# Altium schematic sheet CSX_Capsense.SchDoc
size A3
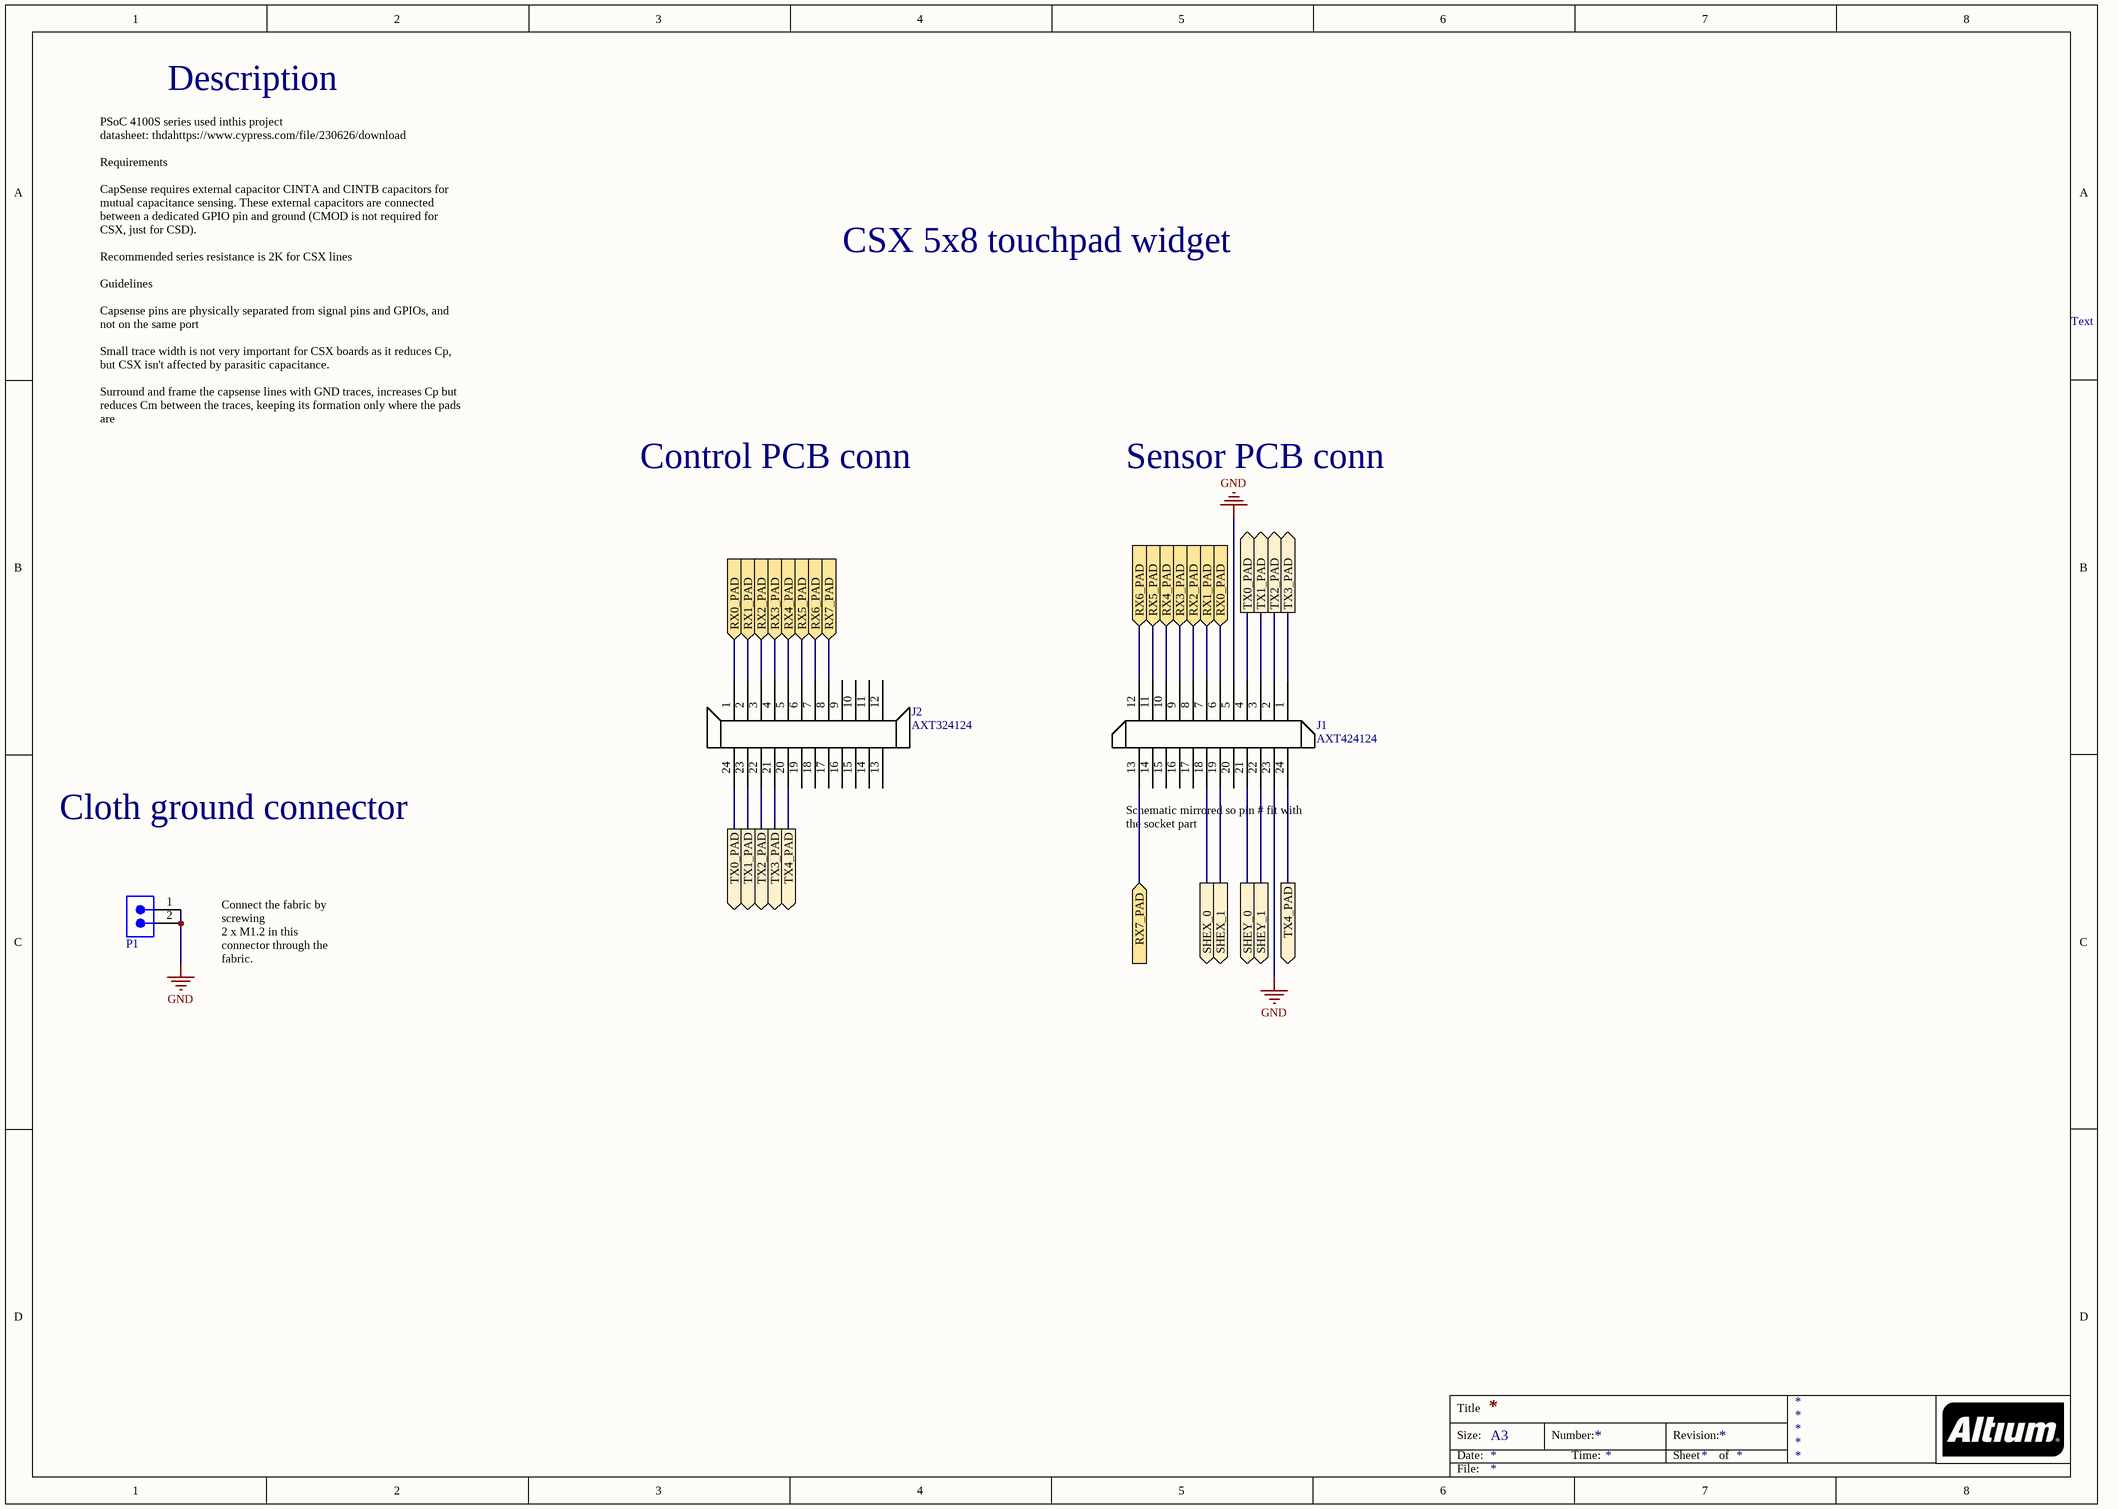
[diagram p0: CSX_Capsense.SchDoc]

## Parts
J1  AXT424124  [AXT424124]
J2  AXT324124  [AXT324124]
P1  MTLW-102-05-T-S-172  [SMTC-MTLW-102-05-X-S-172]  (value not drawn)

## Ports
RX0_PAD (in), RX1_PAD (in), RX2_PAD (in), RX3_PAD (in), RX4_PAD (in), RX5_PAD (in), RX6_PAD (in), RX7_PAD (in), SHEX_0 (out), SHEX_1 (out), SHEY_0 (out), SHEY_1 (out), TX0_PAD (out), TX1_PAD (out), TX2_PAD (out), TX3_PAD (out), TX4_PAD (out)

## Nets
GND: J1.5 J1.23 P1.1 P1.2
RX0_PAD: J1.6 J2.1 ; port RX0_PAD
RX1_PAD: J1.7 J2.2 ; port RX1_PAD
RX2_PAD: J1.8 J2.3 ; port RX2_PAD
RX3_PAD: J1.9 J2.4 ; port RX3_PAD
RX4_PAD: J1.10 J2.5 ; port RX4_PAD
RX5_PAD: J1.11 J2.6 ; port RX5_PAD
RX6_PAD: J1.12 J2.7 ; port RX6_PAD
RX7_PAD: J1.13 J2.8 ; port RX7_PAD
SHEX_0: J1.18 ; port SHEX_0
SHEX_1: J1.19 ; port SHEX_1
SHEY_0: J1.21 ; port SHEY_0
SHEY_1: J1.22 ; port SHEY_1
TX0_PAD: J1.4 J2.24 ; port TX0_PAD
TX1_PAD: J1.3 J2.23 ; port TX1_PAD
TX2_PAD: J1.2 J2.22 ; port TX2_PAD
TX3_PAD: J1.1 J2.21 ; port TX3_PAD
TX4_PAD: J1.24 J2.20 ; port TX4_PAD

Not connected (* = marked no-connect by the designer): J1 14 15 16 17 20; J2 9 10 11 12 13 14 15 16 17 18 19

## Notes on the sheet
- Description
- CSX 5x8 touchpad widget
- Text
- Control PCB conn
- Sensor PCB conn
- PSoC 4100S series used inthis project
  datasheet: thdahttps://www.cypress.com/file/230626/download
  Requirements
  CapSense requires external capacitor CINTA and CINTB capacitors for mutual capacitance sensing. These external capacitors are connected between a dedicated GPIO pin and ground (CMOD is not required for CSX, just for CSD).
  Recommended series resistance is 2K for CSX lines
  Guidelines
  Capsense pins are physically separated from signal pins and GPIOs, and not on the same port
  Small trace width is not very important for CSX boards as it reduces Cp, but CSX isn't affected by parasitic capacitance.
  Surround and frame the capsense lines with GND traces, increases Cp but reduces Cm between the traces, keeping its formation only where the pads are
- Cloth ground connector
- Connect the fabric by screwing
  2 x M1.2 in this connector through the fabric.
- Title
- Size:
- Date:
- A3
- Number:
- Time:
- Revision:
- Sheet
- of
- File:
- (in symbol AXT424124) Schematic mirrored so pin # fit with the socket part

## Library data of the parts
P1 = CMP-1024-00065-1: Low Profile .025" SQ Post Header, Through-hole, Vertical, -55 to 105 degC, 2.54 mm Pitch, 2-Pin, Male, RoHS; Manufacturer: Samtec; Pitch: 2.54 mm; ComponentLink2URL: http://www.samtec.com/documents/webfiles/pdf/MTLW_TH.PDF; PackageReference: MTLW-102-05-X-S-172; Mounting Technology: Through-hole; DatasheetVersion: F-214; Temperature Range: -55 to 105 degC; ComponentLink2Description: Datasheet; Orientation: Vertical; ComponentLink3Description: Package Specification; RoHS: True; PackageDescription: Low Profile Terminal Assembly; ComponentLink3URL: http://www.samtec.com/documents/webfiles/cpdf/MTLW-1XX-XX-XX-X-XXX-XX-XX-MKT1.pdf; ComponentLink1Description: Manufacturer URL; PartNumber: MTLW-102-05-T-S-172; PackageVersion: T, 6/1991; ComponentLink1URL: http://www.samtec.com